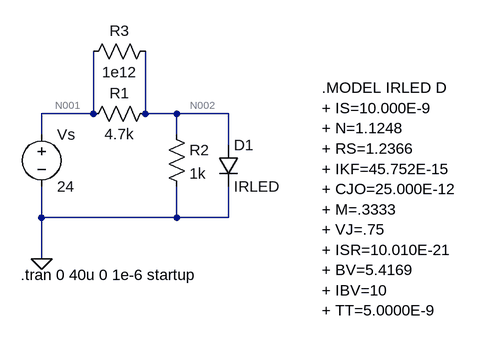
[diagram p0: schematic ltspice_Sanwo_MOSFET_board__24V.asc]
ltspice_Sanwo_MOSFET_board__24V.asc, the LTspice schematic file:
Version 4
SHEET 1 1588 680
WIRE 0 -16 0 -112
WIRE 0 -16 -80 -16
WIRE 80 -16 80 -112
WIRE 128 -16 80 -16
WIRE 208 -16 128 -16
WIRE -80 16 -80 -16
WIRE 128 16 128 -16
WIRE 208 32 208 -16
WIRE -80 144 -80 96
WIRE 128 144 128 96
WIRE 128 144 -80 144
WIRE 208 144 208 96
WIRE 208 144 128 144
WIRE -80 208 -80 144
FLAG -80 208 0
SYMBOL res -16 0 R270
WINDOW 0 32 56 VTop 2
WINDOW 3 0 56 VBottom 2
SYMATTR InstName R1
SYMATTR Value 4.7k
SYMBOL res 112 0 R0
SYMATTR InstName R2
SYMATTR Value 1k
SYMBOL voltage -80 0 R0
WINDOW 123 0 0 Left 0
WINDOW 39 0 0 Left 0
SYMATTR InstName Vs
SYMATTR Value 24
SYMBOL diode 192 32 R0
SYMATTR InstName D1
SYMATTR Value IRLED
SYMBOL res -16 -96 R270
WINDOW 0 32 56 VTop 2
WINDOW 3 0 56 VBottom 2
SYMATTR InstName R3
SYMATTR Value 1e12
TEXT -112 232 Left 2 !.tran 0 40u 0 1e-6 startup
TEXT 352 -56 Left 2 !.MODEL IRLED D\n+ IS=10.000E-9\n+ N=1.1248\n+ RS=1.2366\n+ IKF=45.752E-15\n+ CJO=25.000E-12\n+ M=.3333\n+ VJ=.75\n+ ISR=10.010E-21\n+ BV=5.4169\n+ IBV=10\n+ TT=5.0000E-9

The netlist it stands for:
* ltspice_Sanwo_MOSFET_board__24V.asc
R1 N001 N002 4.7k
R2 N002 0 1k
Vs N001 0 24
D1 N002 0 IRLED
R3 N001 N002 1e12
.model D D
.lib standard.dio
.tran 0 40u 0 1e-6 startup
.MODEL IRLED D
+ IS=10.000E-9
+ N=1.1248
+ RS=1.2366
+ IKF=45.752E-15
+ CJO=25.000E-12
+ M=.3333
+ VJ=.75
+ ISR=10.010E-21
+ BV=5.4169
+ IBV=10
+ TT=5.0000E-9
.backanno
.end

* Results of the author's LTspice run, read from the files saved beside the schematic
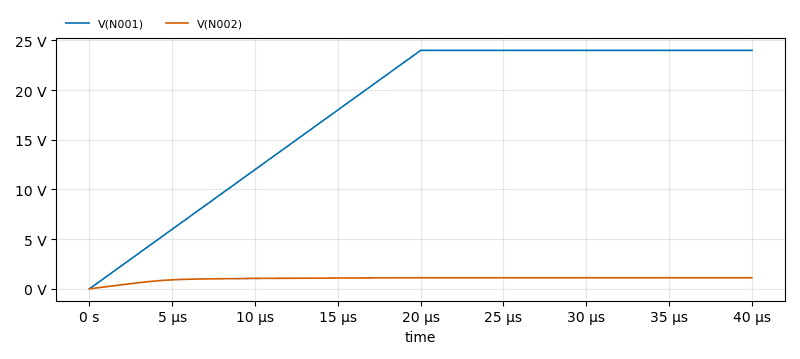
[diagram p1: Transient Analysis of ltspice_Sanwo_MOSFET_board__24V.asc, plotted from the saved traces]
* Transient Analysis, 1 run:
*   V(N001): min 0 V, max 24 V, average 18 V, rms 19.63 V, last 24 V
*   V(N002): min 0 V, max 1.109 V, average 1.011 V, rms 1.035 V, last 1.109 V